# Altium schematic sheet SIDE-PROXIMITY-IR-SENSOR .SchDoc
size A4; SheetNumber: 20; SheetTotal: 32
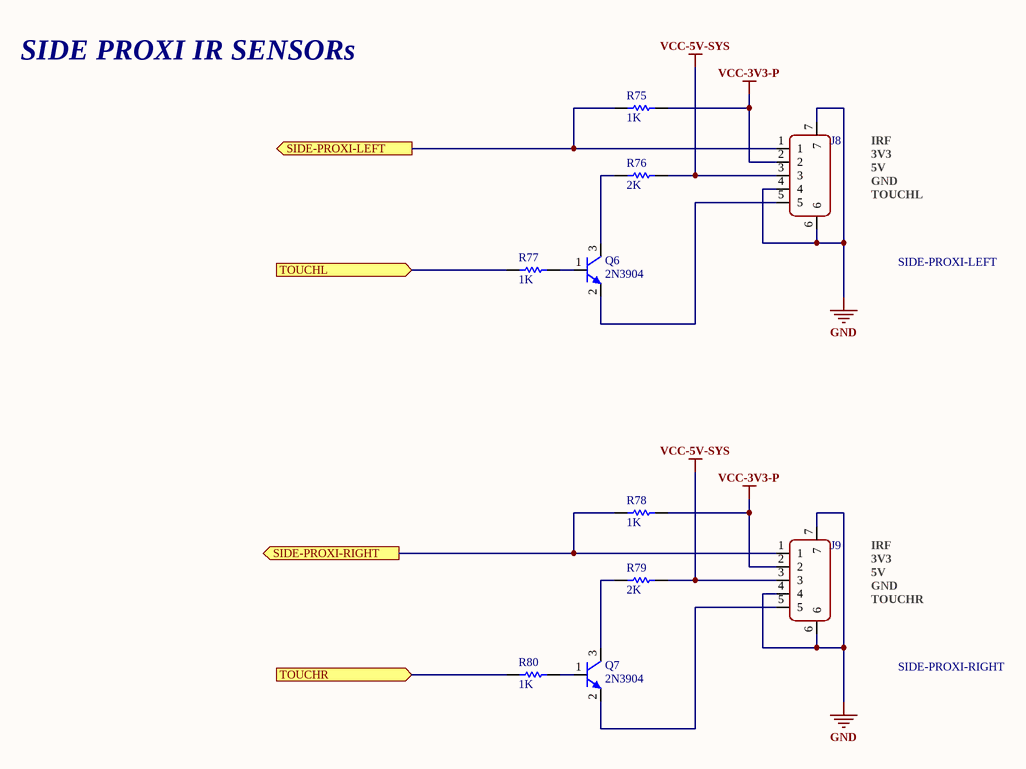
[diagram p0: SIDE-PROXIMITY-IR-SENSOR .SchDoc]

## Parts
J8  SIDE-PROXI-LEFT  [CONN-SMD_5P-P1.50_ZX-ZH1.5-5PWT]
J9  SIDE-PROXI-RIGHT  [CONN-SMD_5P-P1.50_ZX-ZH1.5-5PWT]
Q6  2N3904  [SOT23-3D]
Q7  2N3904  [SOT23-3D]
R75  1K  [RES-0402]
R76  2K  [RES-0402]
R77  1K  [RES-0402]
R78  1K  [RES-0402]
R79  2K  [RES-0402]
R80  1K  [RES-0402]

## Ports
SIDE-PROXI-LEFT (out, see Controller-RK3562-TOP[4A]), SIDE-PROXI-RIGHT (out, see Controller-RK3562-TOP[4A]), TOUCHL (in, see Controller-RK3562-TOP[4A]), TOUCHR (in, see Controller-RK3562-TOP[4A])

## Nets
GND: J8.4 J8.6 J8.7 J9.4 J9.6 J9.7
VCC-3V3-P: J8.2 J9.2 R75.2 R78.2
VCC-5V-SYS: J8.3 J9.3 R76.1 R79.1
SIDE-PROXI-LEFT: J8.1 R75.1 ; port SIDE-PROXI-LEFT
SIDE-PROXI-RIGHT: J9.1 R78.1 ; port SIDE-PROXI-RIGHT
TOUCHL: R77.1 ; port TOUCHL
TOUCHR: R80.1 ; port TOUCHR
NetJ8_5: J8.5 Q6.2(E)
NetJ9_5: J9.5 Q7.2(E)
NetQ6_1: Q6.1(B) R77.2
NetQ6_3: Q6.3(C) R76.2
NetQ7_1: Q7.1(B) R80.2
NetQ7_3: Q7.3(C) R79.2

## Notes on the sheet
- SIDE PROXI IR SENSORs
- IRF
- 3V3
- 5V
- GND
- TOUCHL
- TOUCHR

## Library data of the parts
J8 J9 = HDRx5: ZX-ZH1.5-5PWT; ManufacturingPartNumber: *; Manufacturer: *; SupplierPartNumber: *; Supplier: *; VoltageRate: *
Q6 Q7 = NPN-SOT23: ManufacturingPartNumber: *; Manufacturer: *; SupplierPartNumber: *; Supplier: *; VoltageRate: *
R75-R80 = Resistor-1: ManufacturingPartNumber: *; Manufacturer: *; SupplierPartNumber: *; Supplier: *; VoltageRate: *